# Altium schematic sheet USBHeaders.SchDoc
size A
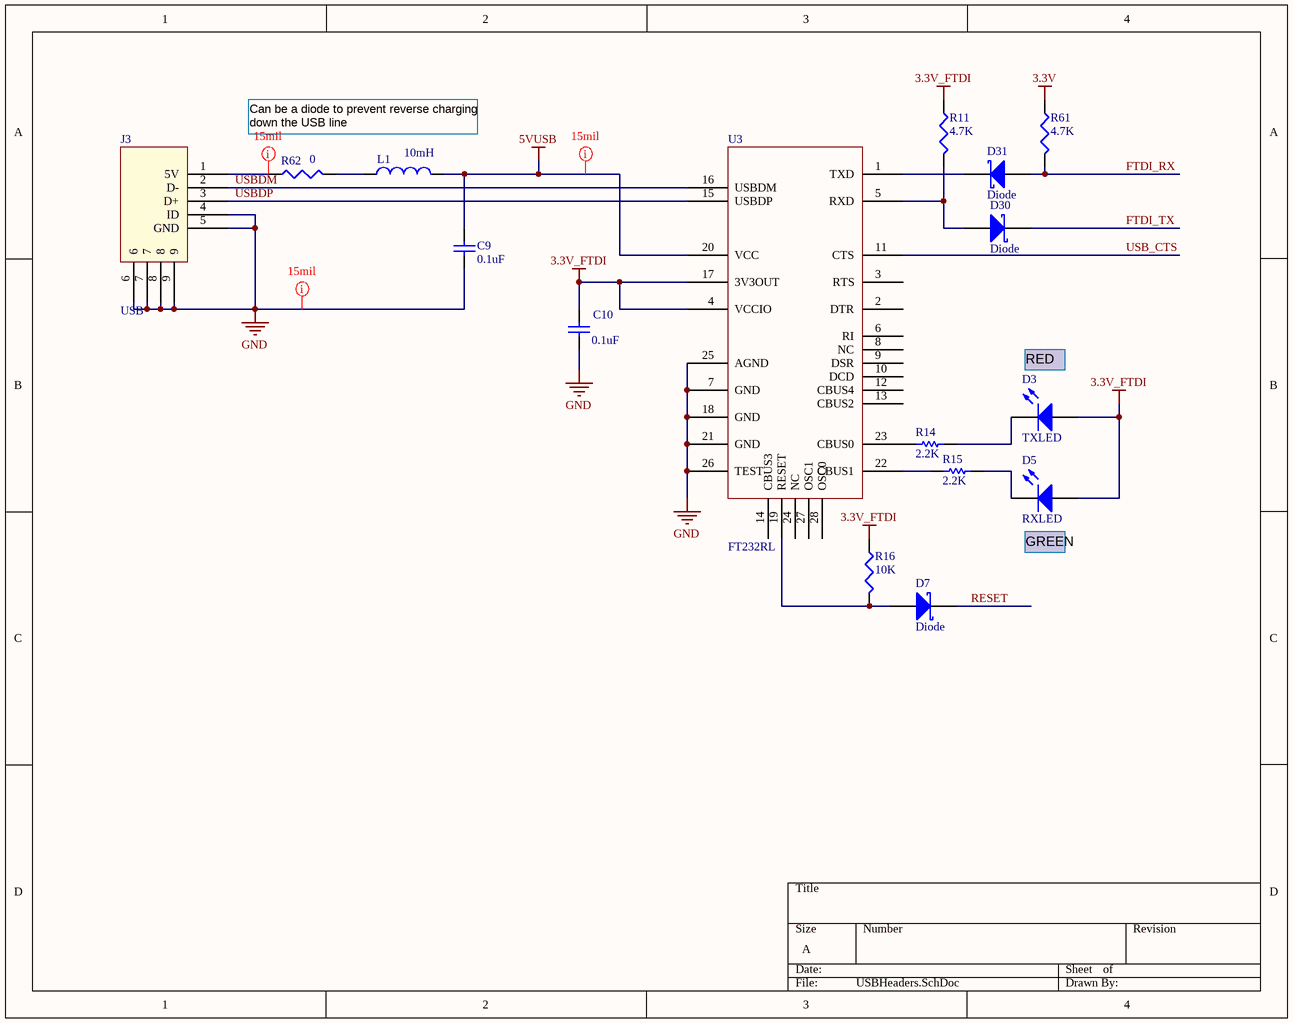
[diagram p0: USBHeaders.SchDoc]

## Parts
C9  value 0.1uF  [CAPC1005L]
C10  value 0.1uF  [CAPC1005L]
D3  TXLED  [SurfaceMount(603)]
D5  RXLED  [SurfaceMount(603)]
D7  Diode  [SurfaceMount(603)]
D30  Diode  [SurfaceMount(603)]
D31  Diode  [SurfaceMount(603)]
J3  USB  [USB Minib (thru-hole)]
L1  value 10mH  [INDC2012L]  (hidden comment: Inductor)
R11  value 4.7K  [RESC1608L]  (hidden comment: Res3)
R14  value 2.2K  [RESC1608L]
R15  value 2.2K  [RESC1608L]
R16  value 10K  [RESC1608L]  (hidden comment: Res3)
R61  value 4.7K  [RESC1608L]  (hidden comment: Res3)
R62  value 0  [RESC1608L]  (hidden comment: Res3)
U3  FT232RL  [SSOP-28]

## Nets
3.3V: R61.1
3.3V_FTDI: C10.2 D3.1(A) D5.1(A) R11.1 R16.1 U3.4(VCCIO) U3.17(3V3OUT)
5VUSB: C9.2 L1.2 U3.20(VCC)
GND: C9.1 C10.1 J3.4(ID) J3.5(GND) J3.6 J3.7 J3.8 J3.9 U3.7(GND) U3.18(GND) U3.21(GND) U3.25(AGND) U3.26(TEST)
FTDI_RX: D31.2(A) R61.2
FTDI_TX: D30.1(K)
RESET: D7.1(K)
USB_CTS: U3.11(CTS)
USBDM: J3.2(D-) U3.16(USBDM)
USBDP: J3.3(D+) U3.15(USBDP)
NetD3_2: D3.2(K) R14.2
NetD5_2: D5.2(K) R15.2
NetD7_2: D7.2(A) R16.2 U3.19(RESET)
NetD30_2: D30.2(A) R11.2 U3.5(RXD)
NetD31_1: D31.1(K) U3.1(TXD)
NetJ3_1: J3.1(5V) R62.1
NetL1_1: L1.1 R62.2
NetR14_1: R14.1 U3.23(CBUS0)
NetR15_1: R15.1 U3.22(CBUS1)

Not connected (* = marked no-connect by the designer): U3 2(DTR) 3(RTS) 6(RI) 8(NC) 9(DSR) 10(DCD) 12(CBUS4) 13(CBUS2) 14(CBUS3) 24(NC) 27(OSC1) 28(OSC0)

## Layout directives
rule Width Constraint [Pref Width = 8mil    Min Width = 8mil    Max Width = 15mil]: 5VUSB, GND, NetJ3_1

## Notes on the sheet
- Can be a diode to prevent reverse charging down the USB line
- (near D3) RED
- (near D5) GREEN

## Library data of the parts
C9 C10 = Cap: Capacitor; Published: 8-Jun-2000; LatestRevisionDate: 17-Jul-2002; LatestRevisionNote: Re-released for DXP Platform.; PackageReference: RAD-0.3; Publisher: Altium Limited
D3 D5 = LED2: Typical RED, GREEN, YELLOW, AMBER GaAs LED; Published: 8-Jun-2000; LatestRevisionDate: 17-Jul-2002; LatestRevisionNote: Re-released for DXP Platform.; PackageVersion: Feb-2002; PackageReference: 3.2X1.6X1.1; Publisher: Altium Limited
D7 D30 D31 = SchottkeyDiode
J3 = USB-ConnTH
L1 = Inductor: Code_IEC: 1005; Published: 8-Jun-2000; LatestRevisionDate: 29-May-2009; LatestRevisionNote: IPC-7351 Footprint Added.; PackageReference: 0402-A; Publisher: Altium Limited; PackageDescription: Chip Inductor; Code_JEITA: 0402
R11 R16 R61 R62 = Res3: Resistor; Published: 8-Jun-2000; LatestRevisionDate: 29-May-2009; LatestRevisionNote: IPC-7351 Footprint Added.; PackageReference: J1-0603; Publisher: Altium Limited; PackageDescription: Chip Resistor
R14 R15 = Res1: Resistor; Published: 8-Jun-2000; LatestRevisionDate: 17-Jul-2002; LatestRevisionNote: Re-released for DXP Platform.; PackageReference: AXIAL-0.3; Publisher: Altium Limited